# EAGLE design IOTopBoard (EAGLE 9.0.0)
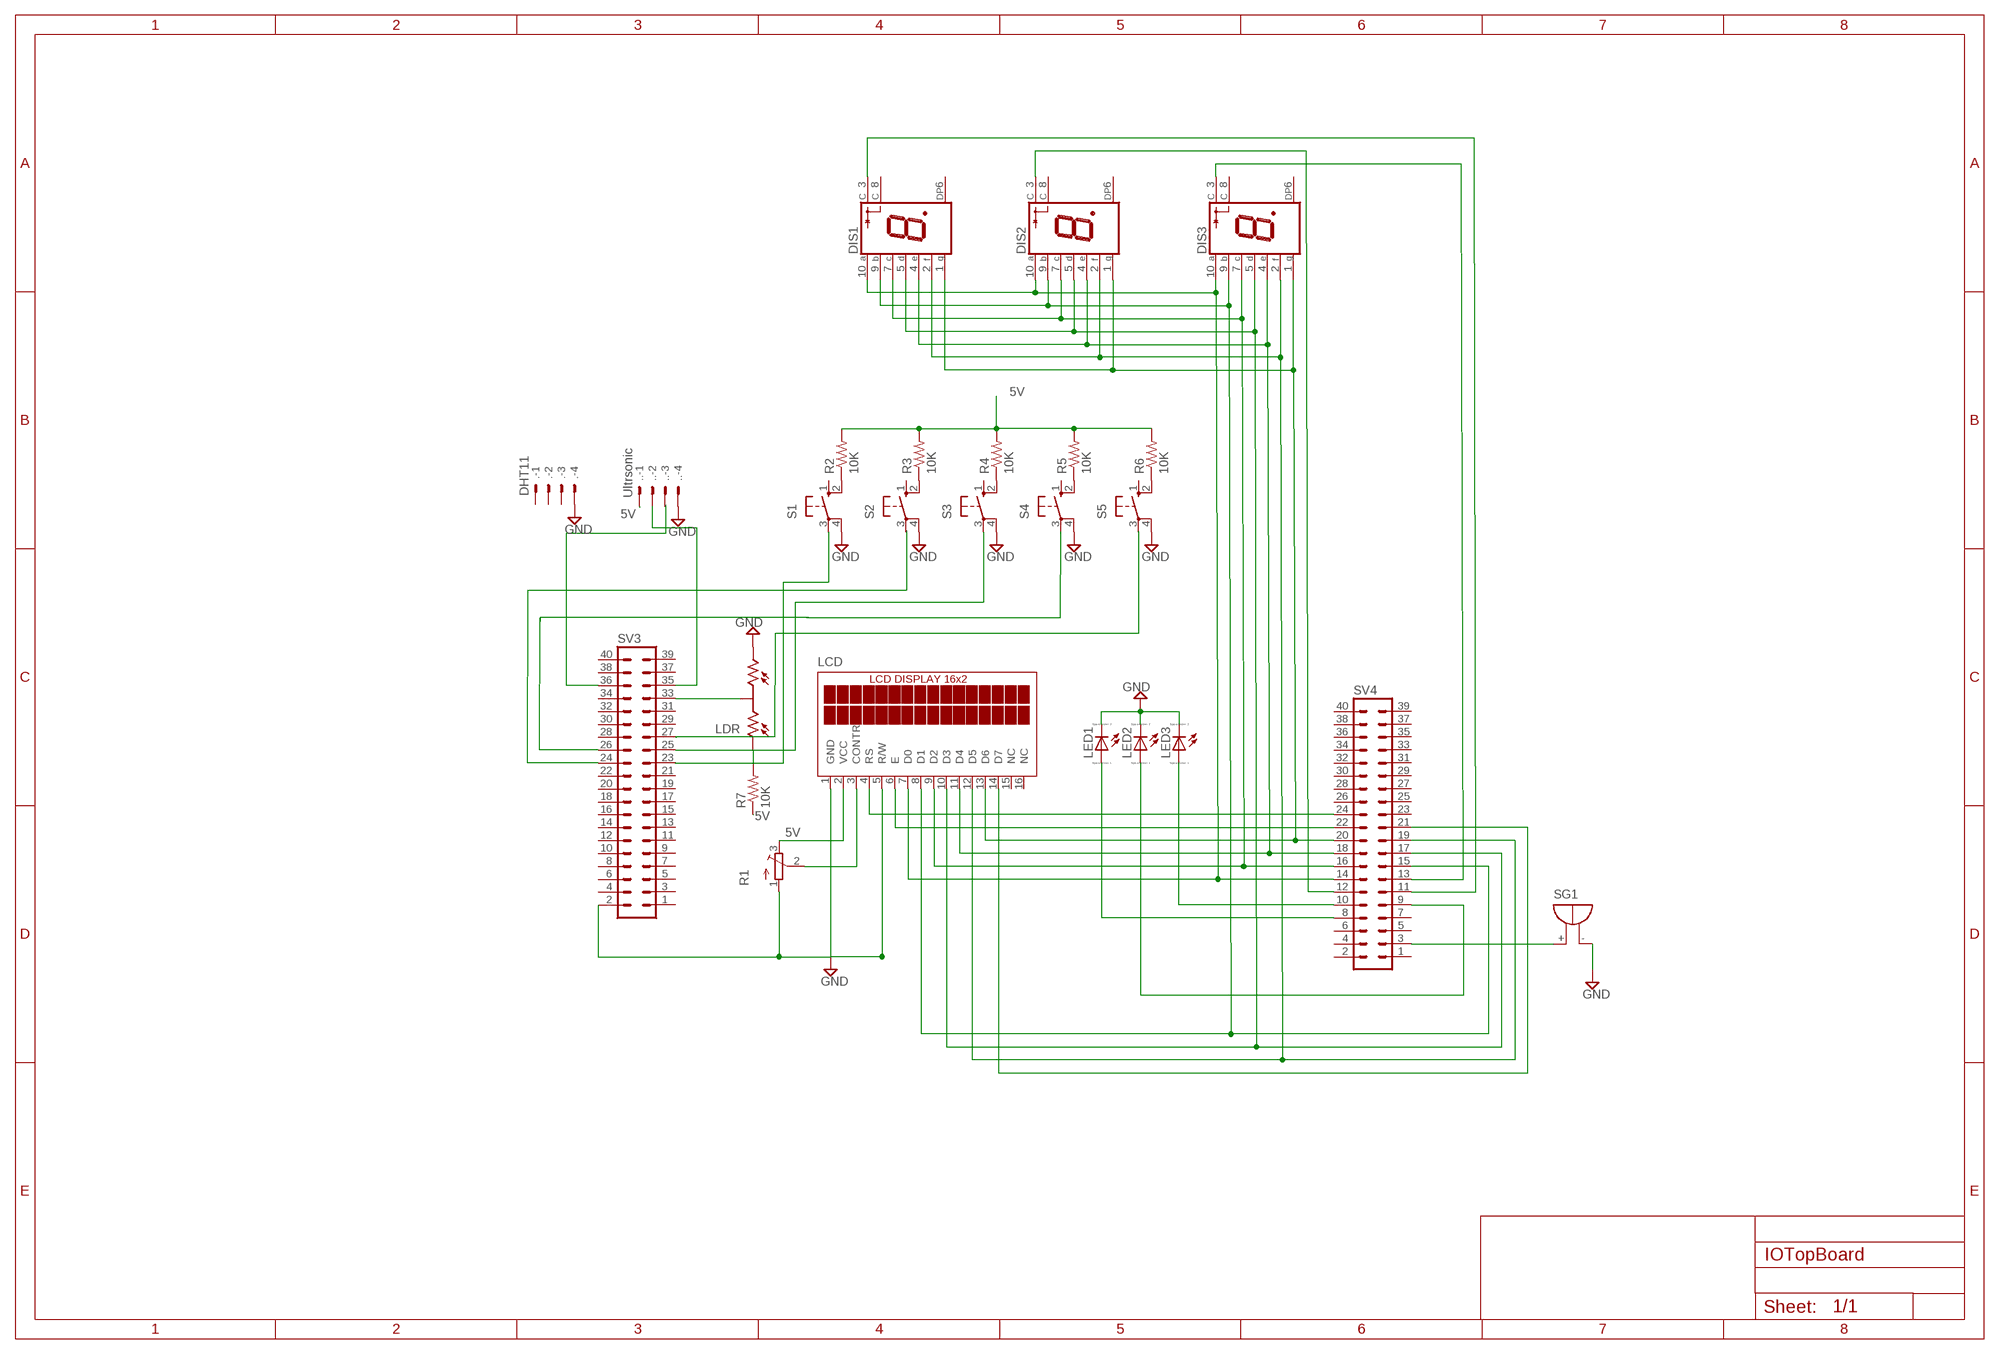
[diagram p0: schematic, sheet 1]

## Parts
.  DHT11  22-23-2041  [22-23-2041]
..  Ultrsonic  22-23-2041  [22-23-2041]
DIS1  S4301B  [S4301B]
DIS2  S4301B  [S4301B]
DIS3  S4301B  [S4301B]
LCD  TUXGR_16X2_R2  [TUXGR_16X2_R2]
LDR  VT83CT  [VT800CT]
LED1  LED_E  [LED_1206]
LED2  LED_E  [LED_1206]
LED3  LED_E  [LED_1206]
R1  TRIM_EU-3223W  [3223W]
R2  10K  R-US_R1206  [R1206]
R3  10K  R-US_R1206  [R1206]
R4  10K  R-US_R1206  [R1206]
R5  10K  R-US_R1206  [R1206]
R6  10K  R-US_R1206  [R1206]
R7  10K  R-US_R1206  [R1206]
S1  10-XX  [B3F-10XX]
S2  10-XX  [B3F-10XX]
S3  10-XX  [B3F-10XX]
S4  10-XX  [B3F-10XX]
S5  10-XX  [B3F-10XX]
SG1  F/HMB  [F/HMB]
SV3  MA20-2  [MA20-2]
SV4  MA20-2  [MA20-2]

## Nets
5V: LCD.2(VCC) LCD.3(CONTR) R1.2(S) R1.3(E) R2.2 R3.2 R4.2 R5.2 R6.2 R7.1
GND: LCD.1(GND) LCD.5(R/W) LDR.3 LED1.C LED2.C LED3.C R1.1(A) S1.4(P1) S2.4(P1) S3.4(P1) S4.4(P1) S5.4(P1) SG1.- SV3.2
N$1: LCD.6(E) SV4.22
N$2: DIS1.3(C) SV4.11
N$3: LCD.14(D7) SV4.21
N$4: DIS2.3(C) SV4.12
N$5: DIS3.3(C) SV4.13
N$6: SG1.+ SV4.3
N$8: LDR.2 SV3.33
N$9: R2.1 S1.2(S1)
N$10: R3.1 S2.2(S1)
N$11: LCD.4(RS) SV4.24
N$12: R4.1 S3.2(S1)
N$13: R5.1 S4.2(S1)
N$14: DIS1.10(A) DIS2.10(A) DIS3.10(A) LCD.7(D0) SV4.14
N$15: LED3.A SV4.10
N$16: LED1.A SV4.8
N$17: LED2.A SV4.9
N$18: R6.1 S5.2(S1)
N$19: LDR.1 R7.2
N$21: SV3.25
N$23: DIS1.7(C) DIS2.7(C) DIS3.7(C) LCD.9(D2) SV4.16
N$24: DIS1.5(D) DIS1.9(B) DIS2.5(D) DIS2.9(B) DIS3.5(D) DIS3.9(B) LCD.8(D1) LCD.10(D3) SV4.15 SV4.17
N$25: DIS1.4(E) DIS2.4(E) DIS3.4(E) LCD.11(D4) SV4.18
N$26: DIS1.2(F) DIS2.2(F) DIS3.2(F) LCD.12(D5) SV4.19
N$27: DIS1.1(G) DIS2.1(G) DIS3.1(G) LCD.13(D6) SV4.20
N$32: SV3.36
Unconnected: ..1 ..2 ..3 ..4 ...1 ...2 ...3 ...4 DIS1.6(DP) DIS1.8(C) DIS2.6(DP) DIS2.8(C) DIS3.6(DP) DIS3.8(C) LCD.15(NC) LCD.16(NC) S1.1(S) S1.3(P) S2.1(S) S2.3(P) S3.1(S) S3.3(P) S4.1(S) S4.3(P) S5.1(S) S5.3(P) SV3.1 SV3.3 SV3.4 SV3.5 SV3.6 SV3.7 SV3.8 SV3.9 SV3.10 SV3.11 SV3.12 SV3.13 SV3.14 SV3.15 SV3.16 SV3.17 SV3.18 SV3.19 SV3.20 SV3.21 SV3.22 SV3.23 SV3.24 SV3.26 SV3.27 SV3.28 SV3.29 SV3.30 SV3.31 SV3.32 SV3.34 SV3.35 SV3.37 SV3.38 SV3.39 SV3.40 SV4.1 SV4.2 SV4.4 SV4.5 SV4.6 SV4.7 SV4.23 SV4.25 SV4.26 SV4.27 SV4.28 SV4.29 SV4.30 SV4.31 SV4.32 SV4.33 SV4.34 SV4.35 SV4.36 SV4.37 SV4.38 SV4.39 SV4.40

## Library data of the parts
. .. = con-molex:22-23-2041: .100" (2.54mm) Center Header - 4 Pin; MF: MOLEX; MPN: 22-23-2041; OC_FARNELL: 1462920; OC_NEWARK: 38C0355
DIS1-DIS3 = led-7-segment:S4301B: Single Digit Seven-Segment Display (cathode common) Source: LITEON .. S4301B.pdf; OC_FARNELL: unknown; OC_NEWARK: unknown
LCD = display-lcd:TUXGR_16X2_R2: Tuxgraphics LCD display 16x2 characters reflective, without background light Source: tuxgr_12x2_r2.pdf; OC_FARNELL: unknown; OC_NEWARK: unknown
LDR = photo-elements:VT83CT: Photo Sensor Dual element VT800CT Series Source: http://optoelectronics.perkinelmer.com/content/Datasheets/DTS_vt800ctseriesdatasheet.pdf; SPICEPREFIX: J
LED1-LED3 = eagle-ltspice:LED_E: LED Source: http://www.osram.convergy.de Source: www.luxeon.com Source: www.kingbright.com; SPICEMODEL: NONE; SPICEPREFIX: D; SPICETYPE: diode
R1 = pot:TRIM_EU-: POTENTIOMETER
R2-R7 = resistor:R-US_: RESISTOR, American symbol
S1-S5 = switch-omron:10-XX: OMRON SWITCH; MPN: B3F-1000; OC_FARNELL: 176432; OC_NEWARK: 36M3542
SG1 = buzzer:F/HMB: BUZZER Source: Buerklin; OC_FARNELL: unknown; OC_NEWARK: unknown
SV3 SV4 = con-lstb:MA20-2: PIN HEADER; OC_FARNELL: unknown; OC_NEWARK: unknown

## Net classes
0 default: width 0.254 mm, drill 0.254 mm, clearance 0.254 mm

## Board
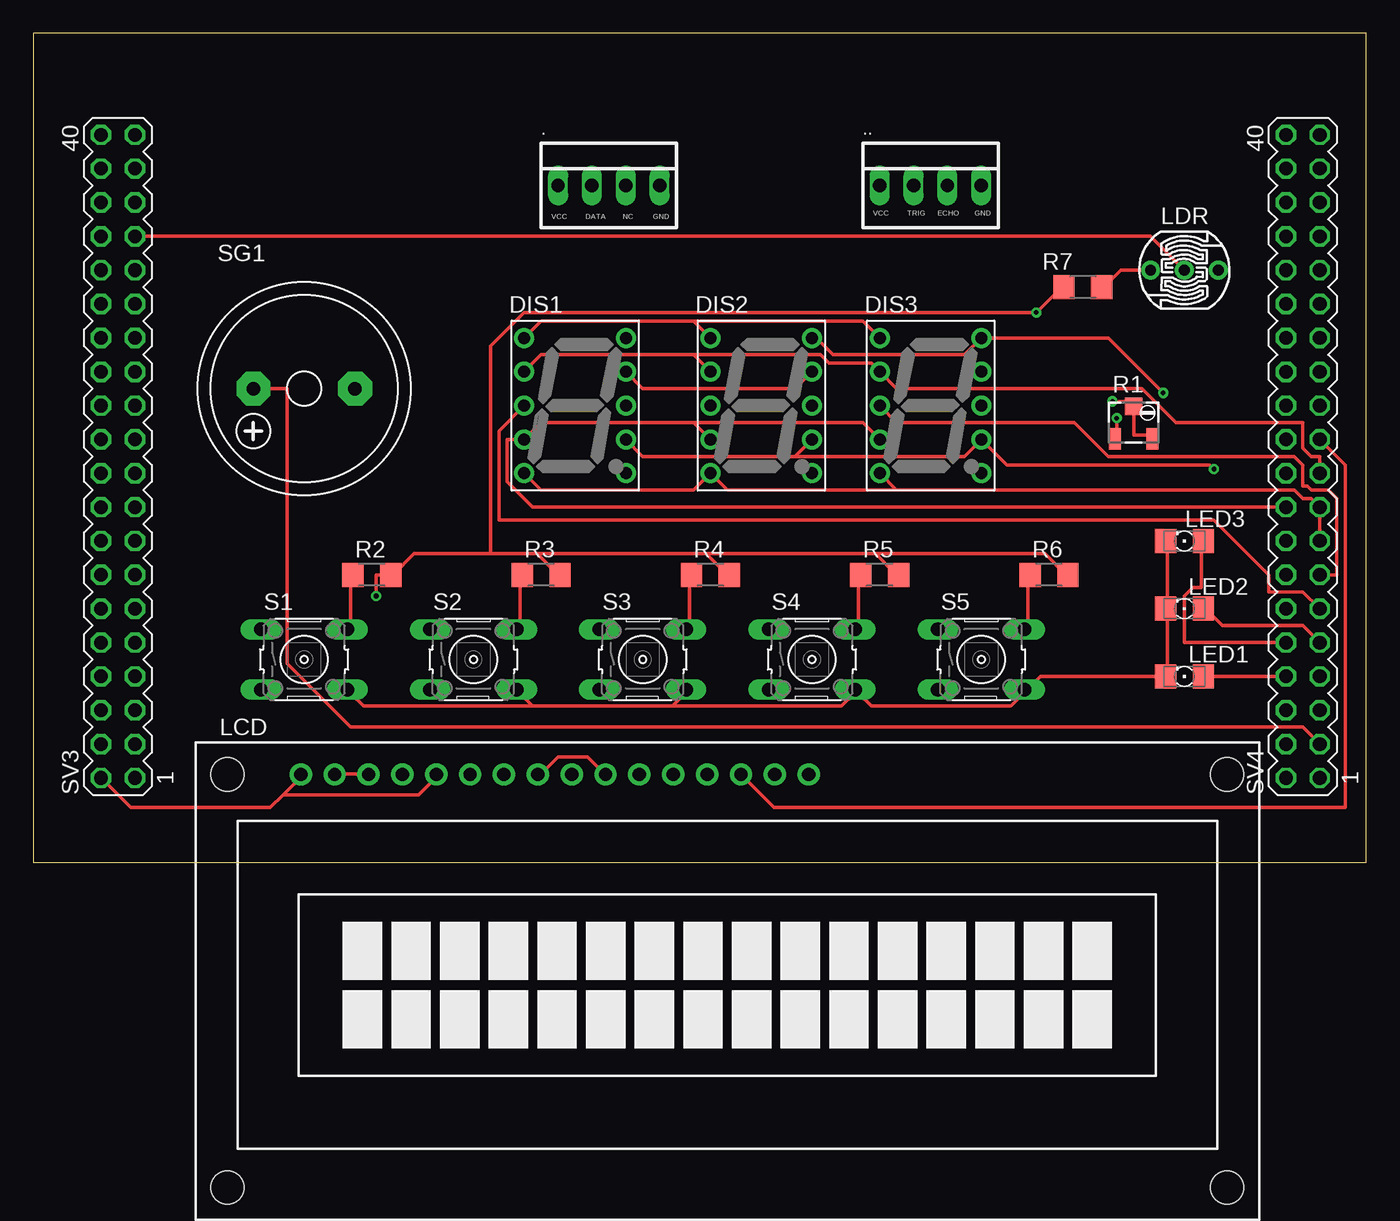
[diagram p1: board, top side]
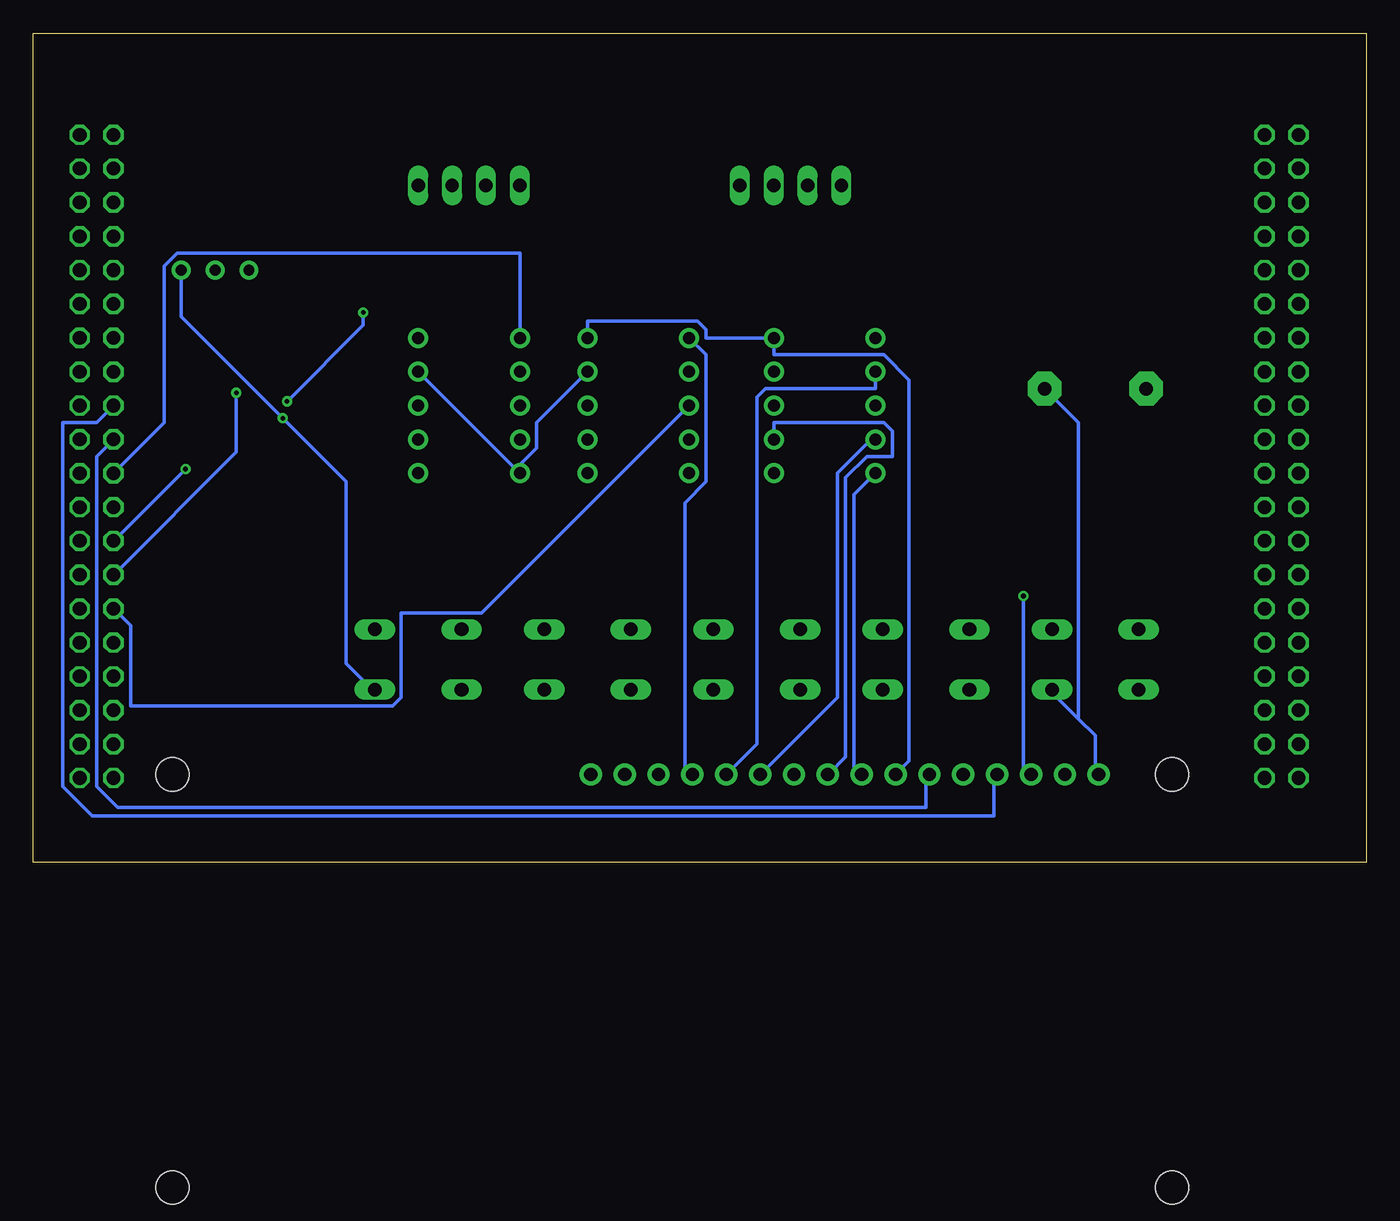
[diagram p2: board, bottom side, seen from below]

Size 100 x 62.22 mm. Coordinates in mm from the lower left corner, seen from the top.
Outline: 0,0 100,0 100,62.22 0,62.22 0,0
Copper layers (1*16): Top 0.035mm / dielectric 1.5mm / Bottom 0.035mm
Design rules "default *": minimum track width 6mil, minimum drill 0.35mm, track to track 10mil, track to pad 10mil, pad to pad 10mil, via to via 10mil, smd to smd 10mil, copper to edge 40mil, drill to drill 6mil, minimum pad ring 10mil, minimum via ring 8mil, stop-mask expansion 4mil, vias tented up to drill 0mil, thermal gap 10mil

### Footprints (pad centres in the part's own frame; a part is rotated, then mirrored left to right if it is on the bottom)
22-23-2041 = drill 1 long: 1 -3.81,0; 2 -1.27,0; 3 1.27,0; 4 3.81,0
S4301B = drill 0.9 pad 1.5: 1 -3.81,5.08; 2 -3.81,2.54; 3 -3.81,0; 4 -3.81,-2.54; 5 -3.81,-5.08; 6 3.81,-5.08; 7 3.81,-2.54; 8 3.81,0; 9 3.81,2.54; 10 3.81,5.08
TUXGR_16X2_R2 = drill 1 pad 1.676: 1 -32,15.5; 2 -29.46,15.5; 3 -26.92,15.5; 4 -24.38,15.5; 5 -21.84,15.5; 6 -19.3,15.5; 7 -16.76,15.5; 8 -14.22,15.5; 9 -11.68,15.5; 10 -9.14,15.5; 11 -6.6,15.5; 12 -4.06,15.5; 13 -1.52,15.5; 14 1.02,15.5; 15 3.56,15.5; 16 6.1,15.5 | hole 2.5: -37.5,-15.5; 37.5,-15.5; -37.5,15.5; 37.5,15.5
VT800CT = drill 0.8 pad 1.4: 1 -2.54,0; 2 0,0; 3 2.54,0
LED_1206 = smd 1.6 x 1.803: A -1.422,0; C 1.422,0
3223W = smd 0.9 x 1.6: 1 -1.4,-1.215; 3 1.4,-1.215 | smd 1.3 x 1.3: 2 0,1.215
R1206 = smd 1.6 x 1.803: 1 -1.422,0; 2 1.422,0
B3F-10XX = drill 1.016 long: 1 -3.251,2.261; 2 3.251,2.261; 3 -3.251,-2.261; 4 3.251,-2.261
F/HMB = drill 1.016 pad 2.54 octagon: + 3.81,0; - -3.81,0
MA20-2 = drill 1.016 octagon: 1 -24.13,-1.27; 2 -24.13,1.27; 3 -21.59,-1.27; 4 -21.59,1.27; 5 -19.05,-1.27; 6 -19.05,1.27; 7 -16.51,-1.27; 8 -16.51,1.27; 9 -13.97,-1.27; 10 -13.97,1.27; 11 -11.43,-1.27; 12 -11.43,1.27; 13 -8.89,-1.27; 14 -8.89,1.27; 15 -6.35,-1.27; 16 -6.35,1.27; 17 -3.81,-1.27; 18 -3.81,1.27; 19 -1.27,-1.27; 20 -1.27,1.27; 21 1.27,-1.27; 22 1.27,1.27; 23 3.81,-1.27; 24 3.81,1.27; 25 6.35,-1.27; 26 6.35,1.27; 27 8.89,-1.27; 28 8.89,1.27; 29 11.43,-1.27; 30 11.43,1.27; 31 13.97,-1.27; 32 13.97,1.27; 33 16.51,-1.27; 34 16.51,1.27; 35 19.05,-1.27; 36 19.05,1.27; 37 21.59,-1.27; 38 21.59,1.27; 39 24.13,-1.27; 40 24.13,1.27

### Placement (x,y rotation side)
.  43.18,50.8 0 top
..  67.31,50.8 0 top
DIS1  40.64,34.29 0 top
DIS2  54.61,34.29 0 top
DIS3  67.31,34.29 0 top
LCD  52.07,-8.89 0 top
LDR  86.36,44.45 0 top
LED1  86.36,13.97 180 top
LED2  86.36,19.05 180 top
LED3  86.36,24.13 180 top
R1  82.55,33.02 0 top
R2  25.4,21.59 0 top
R3  38.1,21.59 0 top
R4  50.8,21.59 0 top
R5  63.5,21.59 0 top
R6  76.2,21.59 0 top
R7  78.74,43.18 0 top
S1  20.32,15.24 0 top
S2  33.02,15.24 0 top
S3  45.72,15.24 0 top
S4  58.42,15.24 0 top
S5  71.12,15.24 0 top
SG1  20.32,35.56 180 top
SV3  6.35,30.48 90 top
SV4  95.25,30.48 90 top

### Tracks (layer width: path | path; a pad name or v marks a point on that pad's centre or on a via)
5V  (via drill 0.35)
  Top 0.254: LCD.2 22.86,6.67 25.08,6.67 LCD.3 | R1.3 83.82,32.07 82.55,32.07 R1.2 82.55,34.29 82.23,34.61 v80.96,34.61 | 37.78,23.18 34.29,23.18 | 34.29,23.18 28.57,23.18 26.99,21.59 R2.2 25.72,21.59 v25.72,20 | 37.78,23.18 39.37,21.59 R3.2 | 50.48,23.18 52.07,21.59 R4.2 | 37.78,23.18 50.48,23.18 | 63.18,23.18 64.77,21.59 R5.2 | 50.48,23.18 63.18,23.18 | 63.18,23.18 75.88,23.18 77.47,21.59 R6.2 | 34.29,23.18 34.29,38.73 36.83,41.27 v75.25,41.27 77.15,43.18 R7.1
  Bottom 0.254: v80.96,34.61 75.25,40.32 v75.25,41.27 | v25.72,20 25.72,6.99 25.4,6.67 LCD.3
GND  (via drill 0.35)
  Top 0.254: SV3.2 7.3,4.13 17.78,4.13 18.73,5.08 | 18.73,5.08 20,6.35 LCD.1 | 18.73,5.08 28.89,5.08 30.16,6.35 LCD.5 | 37.47,11.75 36.51,12.7 S2.4 | 47.94,11.75 37.47,11.75 | 47.94,11.75 48.9,12.7 S3.4 | 47.94,11.75 60.64,11.75 61.59,12.7 S4.4 61.91,12.7 62.87,11.75 73.34,11.75 74.3,12.7 S5.4 74.61,13.02 75.56,13.97 LED1.C 85.09,13.97 85.09,19.05 | v81.28,33.34 81.28,32.07 R1.1 | 85.09,19.05 85.09,24.13 LED3.C | 85.09,19.05 LED2.C | 37.47,11.75 24.77,11.75 23.81,12.7 S1.4
  Bottom 0.254: 21.59,10.79 20.32,9.53 20.32,6.67 LCD.1 | 21.59,10.79 23.5,12.7 S1.4 | SG1.- 21.59,33.02 21.59,10.79 | LDR.3 88.9,40.96 v81.28,33.34 76.52,28.57 76.52,14.92 74.61,13.02 S5.4
N$1
  Bottom 0.254: SV4.22 95.25,30.48 95.25,5.71 93.66,4.13 33.02,4.13 33.02,6.35 LCD.6
N$2
  Top 0.254: DIS1.3 34.92,32.38 34.92,25.72 88.58,25.72 92.71,21.59 92.71,20.32 95.25,20.32 SV4.11
N$3
  Top 0.254: SV4.21 98.42,29.84 98.42,4.13 55.56,4.13 53.34,6.35 LCD.14
N$4
  Bottom 0.254: DIS2.3 66.36,18.73 72.39,18.73 72.39,12.38 73.03,11.75 92.71,11.75 92.71,17.78 SV4.12
N$5
  Top 0.254: DIS3.3 64.77,33.02 78.11,33.02 80.64,30.48 94.61,30.48 95.25,29.84 95.25,28.26 95.57,28.26 95.89,27.94 97.16,27.94 97.79,27.3 97.79,21.59 SV4.13
N$6
  Top 0.254: SV4.3 95.25,10.16 23.81,10.16 19.05,14.92 19.05,35.56 SG1.+
N$8
  Top 0.254: LDR.2 83.82,46.99 SV3.33
N$9
  Top 0.254: R2.1 23.81,21.59 23.81,17.78 S1.2
N$10
  Top 0.254: R3.1 36.51,21.59 36.51,17.78 S2.2
N$11
  Bottom 0.254: SV4.24 95.25,33.02 97.79,33.02 97.79,5.71 95.57,3.49 27.94,3.49 27.94,6.35 LCD.4
N$12
  Top 0.254: R4.1 49.21,21.59 49.21,17.78 S3.2
N$13
  Top 0.254: R5.1 61.91,21.59 61.91,17.78 S4.2
N$14  (via drill 0.35)
  Top 0.254: DIS2.10 58.74,39.37 60.01,38.1 69.85,38.1 DIS3.10 80.64,39.37 v84.77,35.24
  Bottom 0.254: DIS2.10 58.42,40.64 50.16,40.64 49.53,40.01 49.53,39.37 DIS1.10 44.45,38.1 36.2,38.1 34.29,36.2 34.29,7.62 35.24,6.67 LCD.7 | SV4.14 84.77,30.8 v84.77,35.24
N$15
  Top 0.254: SV4.10 86.36,16.51 86.36,20 87,20.64 87.63,20.64 87.63,24.13 LED3.A
N$16
  Top 0.254: SV4.8 LED1.A
N$17
  Top 0.254: SV4.9 95.25,17.78 89.22,17.78 87.95,19.05 LED2.A
N$18
  Top 0.254: R6.1 74.61,21.59 74.61,17.78 S5.2
N$19
  Top 0.254: LDR.1 81.6,44.45 80.33,43.18 R7.2
N$23  (via drill 0.35)
  Top 0.254: DIS1.7 45.72,30.48 57.15,30.48 | DIS2.7 57.15,30.48 | 57.15,30.48 69.85,30.48 DIS3.7 73.03,29.84 88.27,29.84 v88.58,29.53
  Bottom 0.254: v88.58,29.53 SV4.16 | DIS1.7 44.45,33.02 36.2,33.02 35.56,32.38 35.56,30.48 37.47,30.48 39.05,28.89 39.05,7.94 40.32,6.67 LCD.9
N$24
  Top 0.254: LCD.8 38.1,6.67 39.37,7.94 41.59,7.94 42.86,6.67 LCD.10 | DIS1.5 38.1,27.94 49.53,27.94 DIS2.5 52.07,27.94 64.77,27.94 | DIS1.9 45.72,35.56 57.15,35.56 DIS2.9 | SV4.15 SV4.17 95.89,27.3 95.25,27.3 94.61,27.94 64.77,27.94 | DIS3.5 64.77,27.94
  Bottom 0.254: DIS1.5 38.42,27.62 38.42,6.99 38.1,6.67 LCD.8 | DIS3.9 63.82,29.53 | DIS2.9 62.23,33.02 62.23,31.11 63.82,29.53 | 63.82,29.53 DIS3.5
N$25
  Top 0.254: 49.53,33.02 38.1,33.02 DIS1.4 35.56,31.75 35.56,28.57 37.47,26.67 SV4.18 | DIS2.4 49.53,33.02 | DIS3.4 62.23,33.02 49.53,33.02
  Bottom 0.254: DIS1.4 37.15,31.75 39.69,29.21 39.69,12.38 45.4,6.67 LCD.11
N$26
  Top 0.254: DIS1.2 38.1,38.1 49.53,38.1 | DIS2.2 49.53,38.1 | 49.53,38.1 59.05,38.1 59.69,37.47 62.87,37.47 DIS3.2 64.77,35.56 83.19,35.56 85.72,33.02 95.25,33.02 95.25,31.11 95.89,30.48 96.52,30.48 SV4.19
  Bottom 0.254: DIS1.2 36.83,35.56 45.09,35.56 45.72,34.92 45.72,8.89 47.94,6.67 LCD.12
N$27
  Top 0.254: DIS1.1 38.1,40.64 49.53,40.64 | DIS2.1 49.53,40.64 | DIS3.1 62.23,40.64 49.53,40.64
  Bottom 0.254: SV4.20 90.17,33.02 90.17,44.77 89.22,45.72 63.5,45.72 DIS3.1 | DIS2.1 49.53,38.1 49.53,28.57 51.12,26.99 51.12,6.99 50.8,6.67 LCD.13

### Text on the board
tPlace: VCC | TRIG | ECHO | GND | VCC | DATA | NC | GND